# EAGLE design double_layer_keypad (EAGLE 9.6.2)
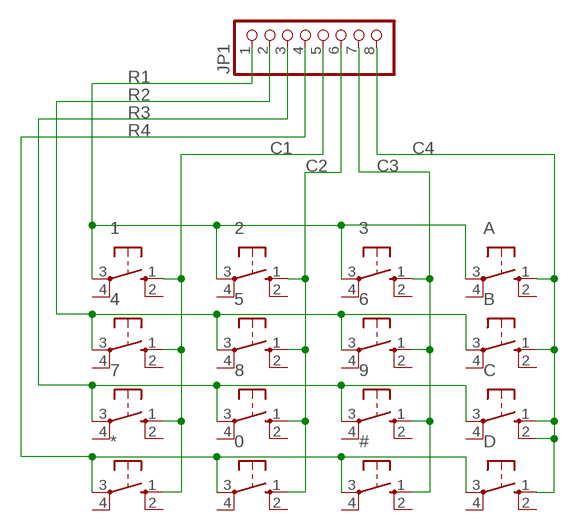
[diagram p0: schematic, sheet 1]

## Parts
0  10-XX  [B3F-10XX]
1  10-XX  [B3F-10XX]
2  10-XX  [B3F-10XX]
3  10-XX  [B3F-10XX]
4  10-XX  [B3F-10XX]
5  10-XX  [B3F-10XX]
6  10-XX  [B3F-10XX]
7  10-XX  [B3F-10XX]
8  10-XX  [B3F-10XX]
9  10-XX  [B3F-10XX]
#  10-XX  [B3F-10XX]
*  10-XX  [B3F-10XX]
A  10-XX  [B3F-10XX]
B  10-XX  [B3F-10XX]
C  10-XX  [B3F-10XX]
D  10-XX  [B3F-10XX]
JP1  PINHD-1X8  [1X08]

## Nets
C1: 1.1(S) 4.1(S) 7.1(S) *.1(S) JP1.5
C2: 0.1(S) 2.1(S) 5.1(S) 8.1(S) JP1.6
C3: 3.1(S) 6.1(S) 9.1(S) #.1(S) JP1.7
C4: A.1(S) B.1(S) C.1(S) C.2(S1) D.1(S) JP1.8
R1: 1.3(P) 2.3(P) 3.3(P) A.3(P) JP1.1
R2: 4.3(P) 5.3(P) 6.3(P) B.3(P) JP1.2
R3: 7.3(P) 8.3(P) 9.3(P) C.3(P) JP1.3
R4: 0.3(P) #.3(P) *.3(P) D.3(P) JP1.4
Unconnected: 0.2(S1) 0.4(P1) 1.2(S1) 1.4(P1) 2.2(S1) 2.4(P1) 3.2(S1) 3.4(P1) 4.2(S1) 4.4(P1) 5.2(S1) 5.4(P1) 6.2(S1) 6.4(P1) 7.2(S1) 7.4(P1) 8.2(S1) 8.4(P1) 9.2(S1) 9.4(P1) #.2(S1) #.4(P1) *.2(S1) *.4(P1) A.2(S1) A.4(P1) B.2(S1) B.4(P1) C.4(P1) D.2(S1) D.4(P1)

## Library data of the parts
0 1-9 # * A B C D = switch-omron:10-XX: OMRON SWITCH; MPN: B3F-1000; OC_FARNELL: 176432; OC_NEWARK: 36M3542
JP1 = pinhead:PINHD-1X8: PIN HEADER

## Board
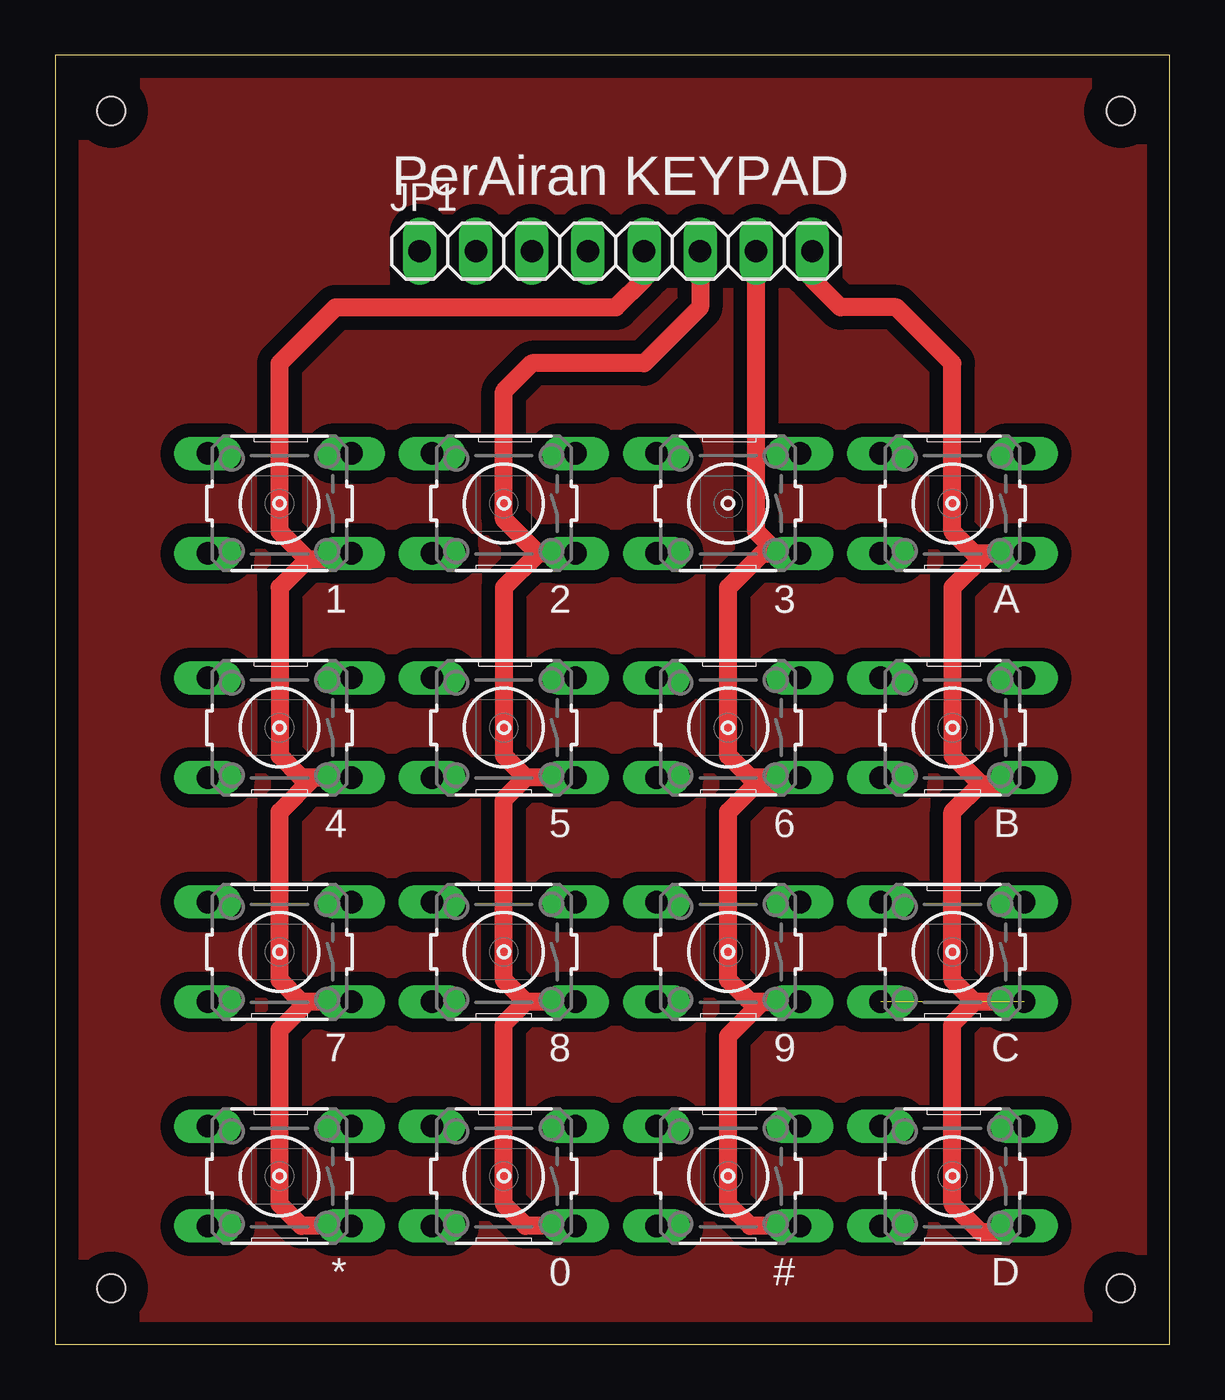
[diagram p1: board, top side]
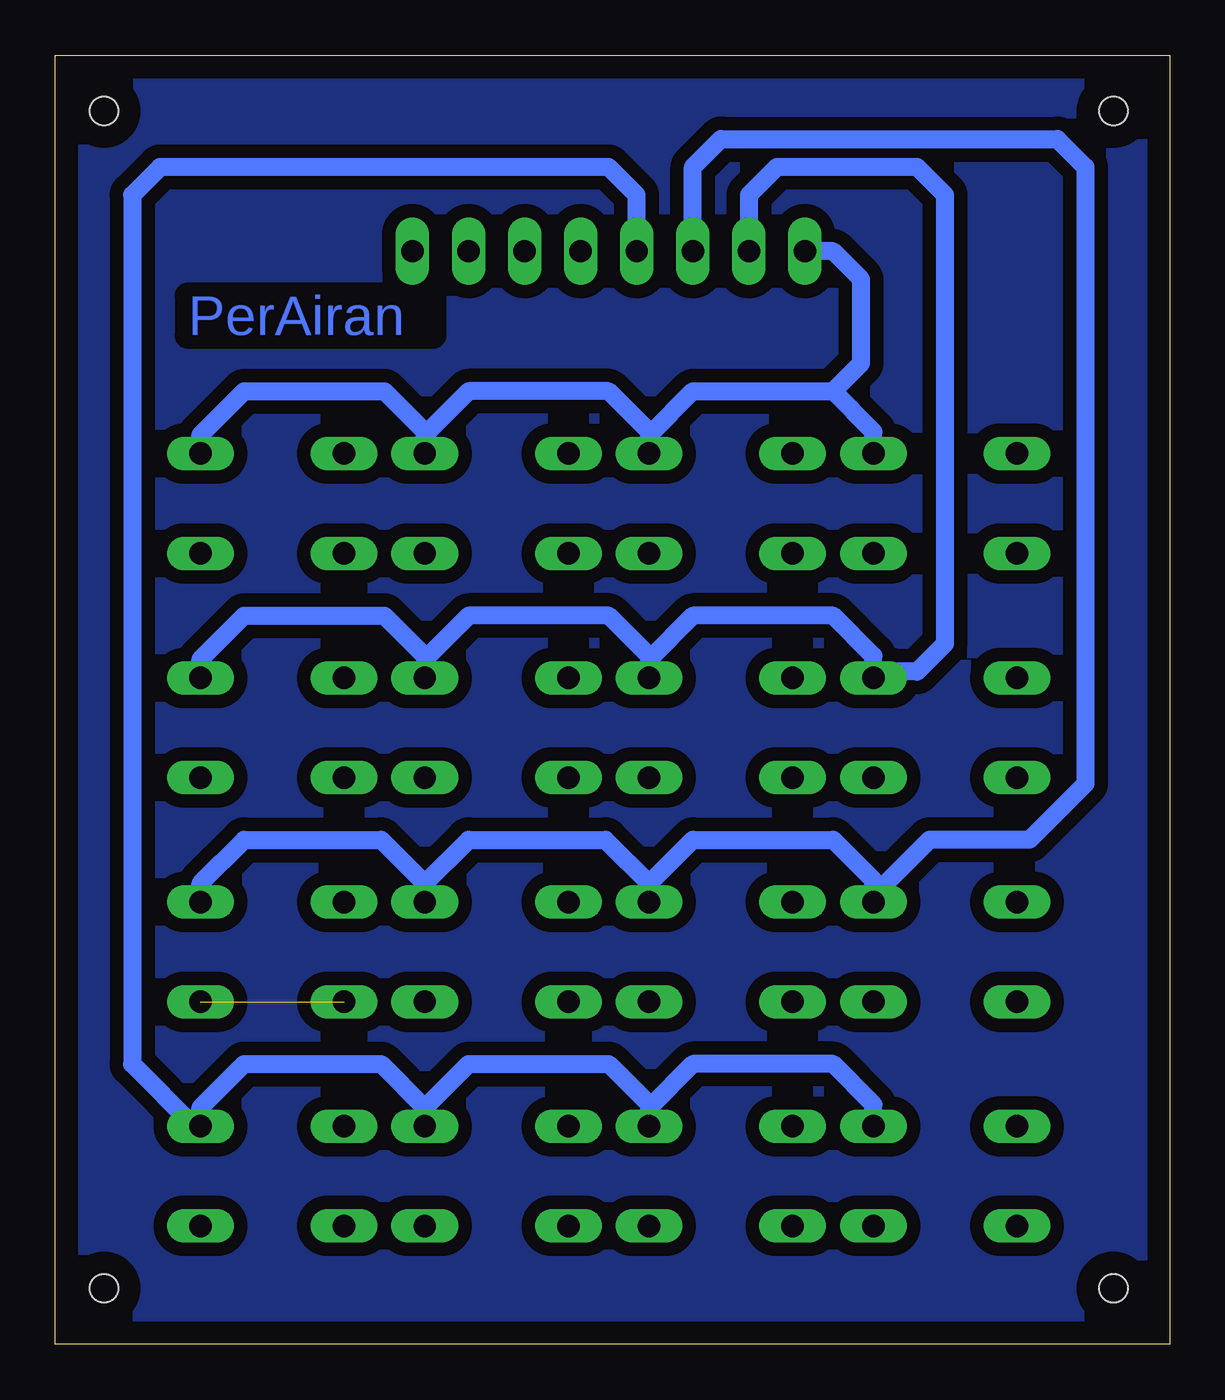
[diagram p2: board, bottom side, seen from below]

Size 50.47 x 58.41 mm. Coordinates in mm from the lower left corner, seen from the top.
Outline: 0,0 50.47,0 50.47,58.41 0,58.41 0,0
Copper layers (1*16): Top 0.035mm / dielectric 1.5mm / Bottom 0.035mm
Design rules "default": minimum track width 6mil, minimum drill 0.35mm, track to track 6mil, track to pad 6mil, pad to pad 6mil, via to via 6mil, smd to smd 6mil, copper to edge 40mil, drill to drill 6mil, minimum pad ring 10mil, minimum via ring 8mil, stop-mask expansion 4mil, vias tented up to drill 0mil, thermal gap 10mil
Holes 1.27 mm at 48.26,55.88 48.26,2.54 2.54,2.54 2.54,55.88

### Footprints (pad centres in the part's own frame; a part is rotated, then mirrored left to right if it is on the bottom)
B3F-10XX = drill 1.016 long: 1 -3.251,2.261; 2 3.251,2.261; 3 -3.251,-2.261; 4 3.251,-2.261
1X08 = drill 1.016 long: 1 -8.89,0; 2 -6.35,0; 3 -3.81,0; 4 -1.27,0; 5 1.27,0; 6 3.81,0; 7 6.35,0; 8 8.89,0

### Placement (x,y rotation side)
0  20.32,7.62 180 top
1  10.16,38.1 180 top
2  20.32,38.1 180 top
3  30.48,38.1 180 top
4  10.16,27.94 180 top
5  20.32,27.94 180 top
6  30.48,27.94 180 top
7  10.16,17.78 180 top
8  20.32,17.78 180 top
9  30.48,17.78 180 top
#  30.48,7.62 180 top
*  10.16,7.62 180 top
A  40.64,38.1 180 top
B  40.64,27.94 180 top
C  40.64,17.78 180 top
D  40.64,7.62 180 top
JP1  25.4,49.53 0 top

### Tracks (layer width: path | path; a pad name or v marks a point on that pad's centre or on a via)
C1
  Top 0.813: 1.1 13.13,35.56 11.43,35.56 | 11.43,35.56 10.16,34.29 10.16,26.67 11.15,25.68 4.1 11.71,25.68 10.16,24.13 10.16,16.51 11.15,15.52 11.43,15.52 | 7.1 11.43,15.52 | *.1 11.15,5.36 10.16,6.35 10.16,14.25 11.43,15.52 | 11.43,35.56 10.16,36.83 10.16,44.45 12.7,46.99 25.4,46.99 26.67,48.26 JP1.5
C2
  Top 0.813: 2.1 21.87,35.84 | 21.87,35.84 20.32,34.29 20.32,26.67 21.31,25.68 | 5.1 21.31,25.68 | 8.1 21.31,15.52 | 21.31,15.52 20.32,16.51 20.32,24.69 21.31,25.68 | 0.1 21.31,5.36 20.32,6.35 20.32,14.53 21.31,15.52 | 21.87,35.84 20.32,37.39 20.32,43.18 21.59,44.45 26.67,44.45 29.21,46.99 JP1.6
C3
  Top 0.813: #.1 31.47,5.36 30.48,6.35 30.48,13.97 32.03,15.52 9.1 31.47,15.52 30.48,16.51 30.48,24.13 31.75,25.4 33.45,25.4 6.1 31.47,25.68 30.48,26.67 30.48,34.29 32.03,35.84 3.1 32.74,35.84 31.75,36.83 JP1.7
C4  (1 unrouted)
  Top 0.813: A.1 42.19,35.84 40.64,34.29 40.64,26.67 41.91,25.4 | 41.91,25.4 43.61,25.4 B.1 | C.1 41.63,15.52 | 41.63,15.52 40.64,16.51 40.64,24.13 41.91,25.4 | D.1 43.61,5.08 41.91,5.08 40.64,6.35 40.64,14.53 41.63,15.52 | 41.91,35.84 A.1 | JP1.8 34.29,48.26 35.56,46.99 38.1,46.99 40.64,44.45 40.64,36.83 41.63,35.84 A.1
N$1
  pour Bottom (isolate 0.61): 2.54,57.15 49.53,57.15 49.53,2.54 49.53,1.27 2.54,1.27 1.27,1.27 1.27,57.15
N$2
  pour Top (isolate 0.61): 1.27,57.15 49.53,57.15 49.53,1.27 1.27,1.27
R1
  Bottom 0.813: 1.3 13.41,41.35 15.24,43.18 | 15.24,43.18 21.59,43.18 23.57,41.2 | 23.57,41.2 23.57,41.35 25.4,43.18 31.75,43.18 33.73,41.2 | 23.57,41.2 2.3 | 3.3 33.73,41.2 | 33.73,41.2 33.73,41.35 35.56,43.18 41.91,43.18 43.89,41.2 A.3 | 15.24,43.18 13.97,44.45 13.97,48.26 15.24,49.53 JP1.1
R2
  Bottom 0.813: 4.3 13.41,30.48 | 13.41,30.48 13.41,31.19 15.24,33.02 21.59,33.02 23.57,31.04 | 23.57,31.04 23.57,31.19 25.4,33.02 31.75,33.02 33.73,31.04 | 23.57,31.04 5.3 | 33.73,31.04 33.73,31.19 35.56,33.02 41.91,33.02 43.89,31.04 B.3 | 33.73,31.04 6.3 | JP1.2 19.05,52.07 17.78,53.34 11.43,53.34 10.16,52.07 10.16,31.75 11.43,30.48 13.41,30.48
R3
  Bottom 0.813: 7.3 13.41,20.32 | 13.41,20.32 13.41,21.03 15.24,22.86 21.59,22.86 23.57,20.88 | 8.3 23.57,20.88 | 9.3 33.73,20.88 | 33.73,20.88 31.75,22.86 25.55,22.86 23.57,20.88 | C.3 43.89,20.88 41.91,22.86 35.71,22.86 33.73,20.88 | JP1.3 21.59,53.34 20.32,54.61 5.08,54.61 3.81,53.34 3.81,25.4 6.35,22.86 10.87,22.86 13.41,20.32
R4
  Bottom 0.813: *.3 13.41,10.87 15.24,12.7 21.59,12.7 23.57,10.72 0.3 23.57,10.87 25.4,12.7 31.75,12.7 33.73,10.72 | #.3 33.73,10.72 | 33.73,10.72 35.71,12.7 41.91,12.7 43.89,10.72 D.3 44.17,9.88 46.99,12.7 46.99,52.07 45.72,53.34 25.4,53.34 24.13,52.07 JP1.4

### Text on the board
Bottom: PerAiran
tNames: PerAiran KEYPAD